# Altium schematic sheet Potentiometers.SchDoc
size A4
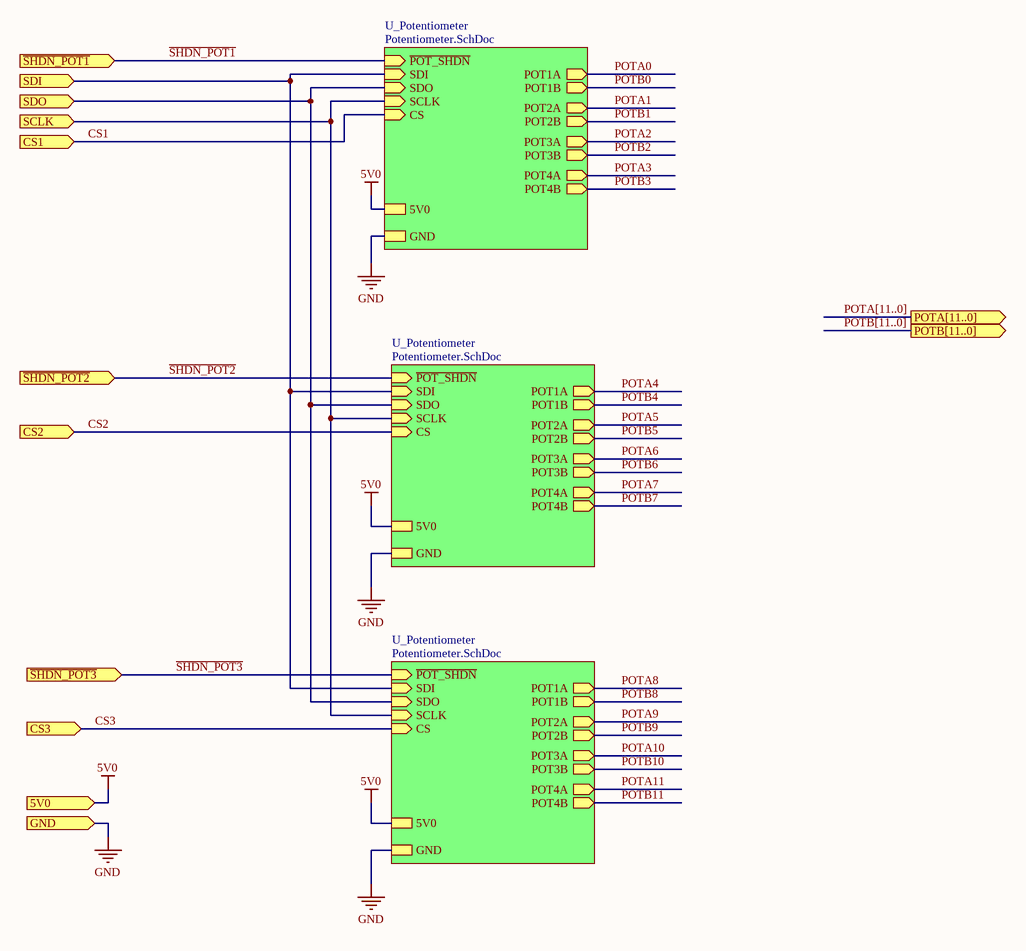
[diagram p0: Potentiometers.SchDoc]

## Sub-sheets
U_Potentiometer = Potentiometer.SchDoc: SDI (in), SDO (in), SCLK (in), CS (in), POT1A (out), POT1B (out), POT2A (out), POT2B (out), POT3A (out), POT3B (out), POT4A (out), POT4B (out), 5V0, GND, ~{POT_SHDN} (in)
U_Potentiometer = Potentiometer.SchDoc: SDI (in), SDO (in), SCLK (in), CS (in), POT1A (out), POT1B (out), POT2A (out), POT2B (out), POT3A (out), POT3B (out), POT4A (out), POT4B (out), 5V0, GND, ~{POT_SHDN} (in)
U_Potentiometer = Potentiometer.SchDoc: SDI (in), SDO (in), SCLK (in), CS (in), POT1A (out), POT1B (out), POT2A (out), POT2B (out), POT3A (out), POT3B (out), POT4A (out), POT4B (out), 5V0, GND, ~{POT_SHDN} (in)

## Ports
5V0, CS1 (in), CS2 (in), CS3 (in), GND, POTA[11..0] (out), POTB[11..0] (out), SCLK (in), SDI (in), SDO (in), ~{SHDN_POT1} (in), ~{SHDN_POT2} (in), ~{SHDN_POT3} (in)

## Nets
5V0: port 5V0, sheet U_Potentiometer/5V0, sheet U_Potentiometer/5V0, sheet U_Potentiometer/5V0
GND: port GND, sheet U_Potentiometer/GND, sheet U_Potentiometer/GND, sheet U_Potentiometer/GND
CS1: port CS1, sheet U_Potentiometer/CS
CS2: port CS2, sheet U_Potentiometer/CS
CS3: port CS3, sheet U_Potentiometer/CS
POTA0: sheet U_Potentiometer/POT1A
POTA1: sheet U_Potentiometer/POT2A
POTA2: sheet U_Potentiometer/POT3A
POTA3: sheet U_Potentiometer/POT4A
POTA4: sheet U_Potentiometer/POT1A
POTA5: sheet U_Potentiometer/POT2A
POTA6: sheet U_Potentiometer/POT3A
POTA7: sheet U_Potentiometer/POT4A
POTA8: sheet U_Potentiometer/POT1A
POTA9: sheet U_Potentiometer/POT2A
POTA10: sheet U_Potentiometer/POT3A
POTA11: sheet U_Potentiometer/POT4A
POTB0: sheet U_Potentiometer/POT1B
POTB1: sheet U_Potentiometer/POT2B
POTB2: sheet U_Potentiometer/POT3B
POTB3: sheet U_Potentiometer/POT4B
POTB4: sheet U_Potentiometer/POT1B
POTB5: sheet U_Potentiometer/POT2B
POTB6: sheet U_Potentiometer/POT3B
POTB7: sheet U_Potentiometer/POT4B
POTB8: sheet U_Potentiometer/POT1B
POTB9: sheet U_Potentiometer/POT2B
POTB10: sheet U_Potentiometer/POT3B
POTB11: sheet U_Potentiometer/POT4B
~{SHDN_POT1}: port ~{SHDN_POT1}, sheet U_Potentiometer/~{POT_SHDN}
~{SHDN_POT2}: port ~{SHDN_POT2}, sheet U_Potentiometer/~{POT_SHDN}
~{SHDN_POT3}: port ~{SHDN_POT3}, sheet U_Potentiometer/~{POT_SHDN}
SCLK: port SCLK, sheet U_Potentiometer/SCLK, sheet U_Potentiometer/SCLK, sheet U_Potentiometer/SCLK
SDI: port SDI, sheet U_Potentiometer/SDI, sheet U_Potentiometer/SDI, sheet U_Potentiometer/SDI
SDO: port SDO, sheet U_Potentiometer/SDO, sheet U_Potentiometer/SDO, sheet U_Potentiometer/SDO

## Buses and harness runs
bus POTA[11..0] = port POTA[11..0]
bus POTB[11..0] = port POTB[11..0]